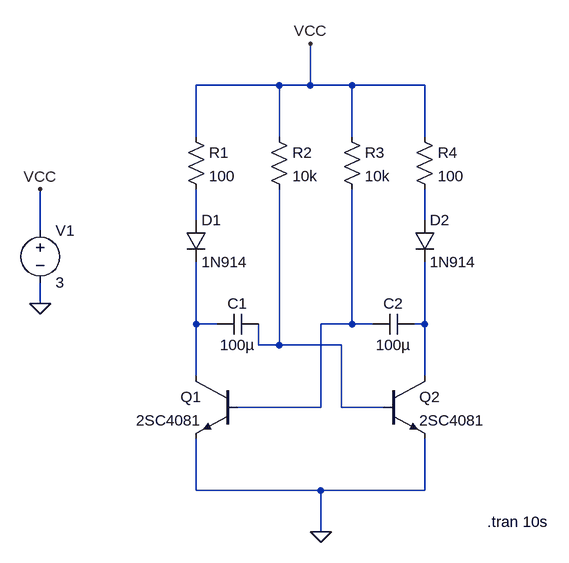
[diagram p0: schematic multi_vibrator.asc]
multi_vibrator.asc, the LTspice schematic file:
Version 4
SHEET 1 904 880
WIRE 416 176 288 176
WIRE 464 176 464 112
WIRE 464 176 416 176
WIRE 528 176 464 176
WIRE 640 176 528 176
WIRE 288 256 288 176
WIRE 416 256 416 176
WIRE 528 256 528 176
WIRE 640 256 640 176
WIRE 288 384 288 336
WIRE 640 384 640 336
WIRE 48 400 48 336
WIRE 48 512 48 480
WIRE 288 544 288 448
WIRE 320 544 288 544
WIRE 528 544 528 336
WIRE 528 544 480 544
WIRE 560 544 528 544
WIRE 640 544 640 448
WIRE 640 544 624 544
WIRE 384 576 384 544
WIRE 416 576 416 336
WIRE 416 576 384 576
WIRE 512 576 416 576
WIRE 288 624 288 544
WIRE 640 624 640 544
WIRE 480 672 480 544
WIRE 480 672 352 672
WIRE 512 672 512 576
WIRE 576 672 512 672
WIRE 288 800 288 720
WIRE 480 800 288 800
WIRE 640 800 640 720
WIRE 640 800 480 800
WIRE 480 864 480 800
FLAG 48 512 0
FLAG 480 864 0
FLAG 48 336 VCC
FLAG 464 112 VCC
SYMBOL res 272 240 R0
SYMATTR InstName R1
SYMATTR Value 100
SYMBOL res 400 240 R0
SYMATTR InstName R2
SYMATTR Value 10k
SYMBOL res 512 240 R0
SYMATTR InstName R3
SYMATTR Value 10k
SYMBOL res 624 240 R0
SYMATTR InstName R4
SYMATTR Value 100
SYMBOL diode 272 384 R0
SYMATTR InstName D1
SYMATTR Value 1N914
SYMATTR Description Light Emitting Diode
SYMATTR Type led
SYMBOL diode 624 384 R0
SYMATTR InstName D2
SYMATTR Value 1N914
SYMATTR Description Light Emitting Diode
SYMATTR Type led
SYMBOL cap 320 560 R270
WINDOW 0 32 32 VTop 2
WINDOW 3 0 32 VBottom 2
SYMATTR InstName C1
SYMATTR Value 100µ
SYMBOL cap 624 528 R90
WINDOW 0 0 32 VBottom 2
WINDOW 3 32 32 VTop 2
SYMATTR InstName C2
SYMATTR Value 100µ
SYMBOL npn 352 624 M0
SYMATTR InstName Q1
SYMATTR Value 2SC4081
SYMBOL npn 576 624 R0
SYMATTR InstName Q2
SYMATTR Value 2SC4081
SYMBOL voltage 48 384 R0
SYMATTR InstName V1
SYMATTR Value 3
TEXT 736 848 Left 2 !.tran 10s

The netlist it stands for:
* multi_vibrator.asc
R1 VCC N001 100
R2 VCC N006 10k
R3 VCC N004 10k
R4 VCC N002 100
D1 N001 N003 1N914
D2 N002 N005 1N914
C1 N003 N006 100µ
C2 N005 N004 100µ
Q1 N003 N004 0 0 2SC4081
Q2 N005 N006 0 0 2SC4081
V1 VCC 0 3
.model D D
.lib standard.dio
.model NPN NPN
.model PNP PNP
.lib standard.bjt
.tran 10s
.backanno
.end